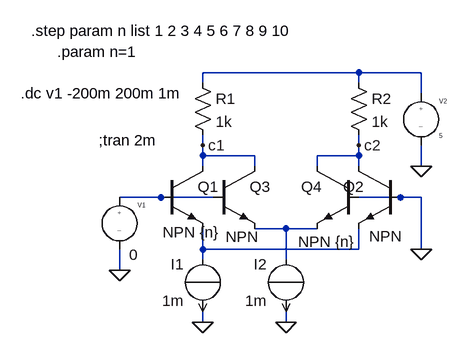
[diagram p0: schematic mult_steilheit.asc]
mult_steilheit.asc, the LTspice schematic file:
Version 4
SHEET 1 880 680
WIRE 432 -48 192 -48
WIRE 528 -48 432 -48
WIRE 192 -32 192 -48
WIRE 432 -32 432 -48
WIRE 528 -16 528 -48
WIRE 192 64 192 48
WIRE 432 64 432 48
WIRE 192 80 192 64
WIRE 272 80 192 80
WIRE 432 80 432 64
WIRE 432 80 368 80
WIRE 192 96 192 80
WIRE 272 96 272 80
WIRE 368 96 368 80
WIRE 432 96 432 80
WIRE 528 96 528 64
WIRE 128 144 64 144
WIRE 208 144 128 144
WIRE 496 144 432 144
WIRE 528 144 496 144
WIRE 320 192 272 192
WIRE 368 192 320 192
WIRE 192 224 192 192
WIRE 432 224 432 192
WIRE 432 224 192 224
WIRE 528 224 528 144
WIRE 192 240 192 224
WIRE 320 240 320 192
WIRE 64 256 64 224
WIRE 192 336 192 320
WIRE 320 336 320 320
FLAG 528 224 0
FLAG 192 336 0
FLAG 64 256 0
FLAG 528 96 0
FLAG 192 64 c1
FLAG 432 64 c2
FLAG 320 336 0
SYMBOL EIT_Semiconductors\\npn 128 96 R0
WINDOW 3 2 102 Left 2
SYMATTR Value NPN {n}
SYMATTR InstName Q1
SYMBOL EIT_Semiconductors\\npn 496 96 M0
WINDOW 3 -2 108 Left 2
SYMATTR InstName Q2
SYMBOL source-I 192 320 R180
WINDOW 0 29 73 Left 2
WINDOW 3 29 17 Left 2
SYMATTR InstName I1
SYMATTR Value 1m
SYMBOL res 176 -48 R0
SYMATTR InstName R1
SYMATTR Value 1k
SYMBOL res 416 -48 R0
SYMATTR InstName R2
SYMATTR Value 1k
SYMBOL source-V 64 128 R0
WINDOW 3 15 104 Left 2
WINDOW 123 0 0 Left 2
WINDOW 39 0 0 Left 2
SYMATTR Value 0
SYMATTR InstName V1
SYMBOL source-V 528 -32 R0
SYMATTR InstName V2
SYMATTR Value 5
SYMBOL source-I 320 320 R180
WINDOW 0 29 73 Left 2
WINDOW 3 29 17 Left 2
SYMATTR InstName I2
SYMATTR Value 1m
SYMBOL EIT_Semiconductors\\npn 208 96 R0
WINDOW 3 19 109 Left 2
SYMATTR InstName Q3
SYMBOL EIT_Semiconductors\\npn 432 96 M0
WINDOW 3 6 116 Left 2
SYMATTR Value NPN {n}
SYMATTR InstName Q4
TEXT 32 56 Left 2 !;tran 2m
TEXT -88 -16 Left 2 !.dc v1 -200m 200m 1m
TEXT -32 -80 Left 2 !.param n=1
TEXT -72 -112 Left 2 !.step param n list 1 2 3 4 5 6 7 8 9 10

The netlist it stands for:
* mult_steilheit.asc
Q1 c1 N002 N004 0 NPN {n}
Q2 c2 0 N004 0 NPN
I1 N004 0 1m
R1 N001 c1 1k
R2 N001 c2 1k
V1 N002 0 0
V2 N001 0 5
I2 N003 0 1m
Q3 c1 N002 N003 0 NPN
Q4 c2 0 N003 0 NPN {n}
.model NPN NPN
.model PNP PNP
.lib standard.bjt
;tran 2m
.dc v1 -200m 200m 1m
.param n=1
.step param n list 1 2 3 4 5 6 7 8 9 10
.backanno
.end